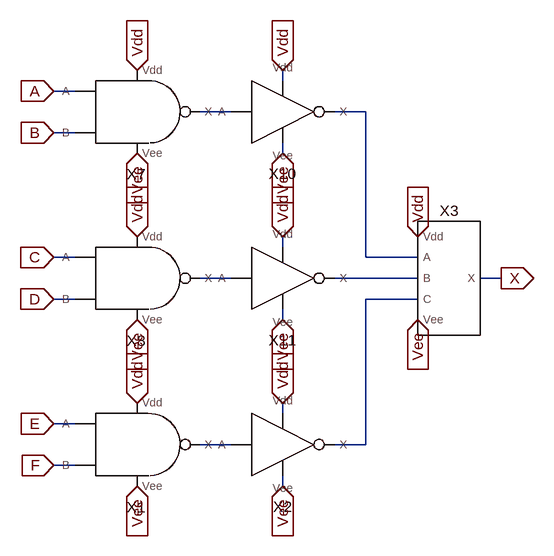
[diagram p0: schematic 6-NAND.asc]
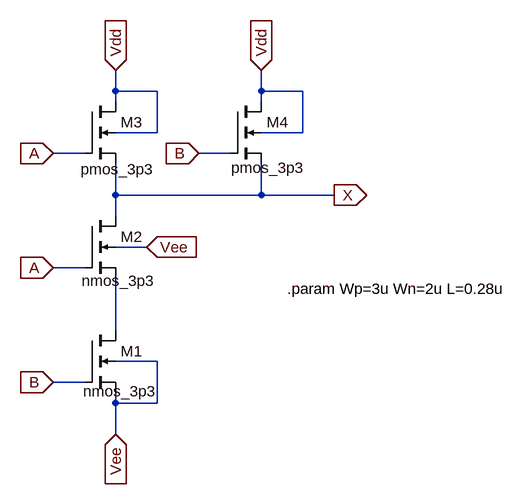
[diagram p1: sub-circuit nand2x1.asc]
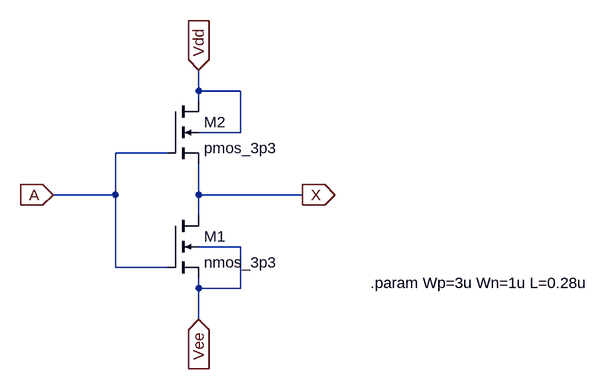
[diagram p2: sub-circuit invx1.asc]
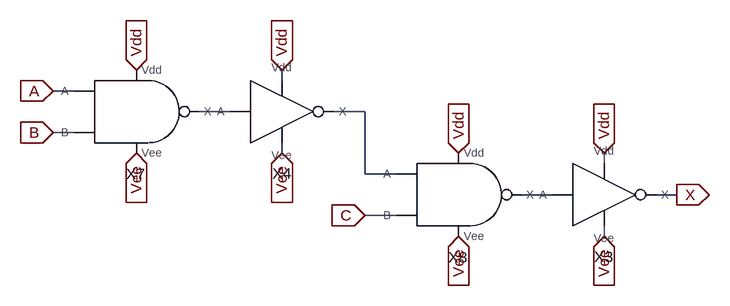
[diagram p3: sub-circuit 3-nand.asc]
6-NAND.asc, the LTspice schematic file:
Version 4.1
SHEET 1 880 680
WIRE -32 -64 -32 -80
WIRE -352 -48 -384 -48
WIRE -112 -16 -160 -16
WIRE 96 -16 48 -16
WIRE -352 16 -384 16
WIRE -32 48 -32 32
WIRE -32 192 -32 176
WIRE -352 208 -384 208
WIRE 96 208 96 -16
WIRE 176 208 96 208
WIRE -112 240 -160 240
WIRE 176 240 48 240
WIRE 304 240 272 240
WIRE -352 272 -384 272
WIRE 176 272 96 272
WIRE -32 304 -32 288
WIRE -32 448 -32 432
WIRE -352 464 -384 464
WIRE -112 496 -160 496
WIRE 96 496 96 272
WIRE 96 496 48 496
WIRE -352 528 -384 528
WIRE -32 560 -32 544
FLAG -256 48 Vee
IOPIN -256 48 In
FLAG -32 -80 Vdd
IOPIN -32 -80 In
FLAG -32 48 Vee
IOPIN -32 48 In
FLAG -256 304 Vee
IOPIN -256 304 In
FLAG -32 176 Vdd
IOPIN -32 176 In
FLAG -32 304 Vee
IOPIN -32 304 In
FLAG -384 -48 A
IOPIN -384 -48 In
FLAG -384 16 B
IOPIN -384 16 In
FLAG -384 208 C
IOPIN -384 208 In
FLAG -384 272 D
IOPIN -384 272 In
FLAG -256 -80 Vdd
IOPIN -256 -80 In
FLAG -256 176 Vdd
IOPIN -256 176 In
FLAG -256 560 Vee
IOPIN -256 560 In
FLAG -32 432 Vdd
IOPIN -32 432 In
FLAG -32 560 Vee
IOPIN -32 560 In
FLAG -384 464 E
IOPIN -384 464 In
FLAG -384 528 F
IOPIN -384 528 In
FLAG -256 432 Vdd
IOPIN -256 432 In
FLAG 176 176 Vdd
IOPIN 176 176 In
FLAG 176 304 Vee
IOPIN 176 304 In
FLAG 304 240 X
IOPIN 304 240 Out
SYMBOL NAND2x1 -256 -16 R0
SYMATTR InstName X7
SYMBOL NAND2x1 -256 240 R0
SYMATTR InstName X8
SYMBOL INVx1 -32 -16 R0
SYMATTR InstName X10
SYMBOL INVx1 -32 240 R0
SYMATTR InstName X11
SYMBOL NAND2x1 -256 496 R0
SYMATTR InstName X1
SYMBOL INVx1 -32 496 R0
SYMATTR InstName X2
SYMBOL 3-NAND 224 240 R0
SYMATTR InstName X3

nand2x1.asc, the sub-circuit schematic file:
Version 4.1
SHEET 1 900 680
WIRE -96 32 -96 0
WIRE -32 32 -96 32
WIRE 128 32 128 0
WIRE 192 32 128 32
WIRE -96 48 -96 32
WIRE 128 48 128 32
WIRE -32 96 -32 32
WIRE -32 96 -96 96
WIRE 192 96 192 32
WIRE 192 96 128 96
WIRE -144 128 -192 128
WIRE 80 128 32 128
WIRE -96 192 -96 144
WIRE 128 192 128 144
WIRE 128 192 -96 192
WIRE 240 192 128 192
WIRE -96 224 -96 192
WIRE -48 272 -96 272
WIRE -144 304 -192 304
WIRE -96 400 -96 320
WIRE -32 448 -96 448
WIRE -144 480 -192 480
WIRE -96 512 -96 496
WIRE -32 512 -32 448
WIRE -32 512 -96 512
WIRE -96 560 -96 512
FLAG -96 0 Vdd
IOPIN -96 0 In
FLAG -192 128 A
IOPIN -192 128 In
FLAG 240 192 X
IOPIN 240 192 Out
FLAG 128 0 Vdd
IOPIN 128 0 In
FLAG -192 304 A
IOPIN -192 304 In
FLAG -192 480 B
IOPIN -192 480 In
FLAG 32 128 B
IOPIN 32 128 In
FLAG -96 560 Vee
IOPIN -96 560 In
FLAG -48 272 Vee
IOPIN -48 272 In
SYMBOL nmos4 -144 400 R0
WINDOW 3 -2 94 Left 2
SYMATTR Value nmos_3p3
SYMATTR InstName M1
SYMATTR Value2 l={L} w={Wn}
SYMBOL nmos4 -144 48 R0
WINDOW 3 -6 104 Left 2
SYMATTR Value pmos_3p3
SYMATTR InstName M3
SYMATTR Value2 l={L} w={Wp}
SYMBOL nmos4 80 48 R0
WINDOW 3 2 102 Left 2
SYMATTR Value pmos_3p3
SYMATTR InstName M4
SYMATTR Value2 l={L} w={Wp}
SYMBOL nmos4 -144 224 R0
WINDOW 3 -4 100 Left 2
SYMATTR Value nmos_3p3
SYMATTR InstName M2
SYMATTR Value2 l={L} w={Wn}
TEXT 168 336 Left 2 !.param Wp=3u Wn=2u L=0.28u

invx1.asc, the sub-circuit schematic file:
Version 4
SHEET 1 2776 836
WIRE 416 -16 416 -48
WIRE 480 -16 416 -16
WIRE 416 0 416 -16
WIRE 480 48 480 -16
WIRE 480 48 416 48
WIRE 368 80 288 80
WIRE 288 144 288 80
WIRE 288 144 192 144
WIRE 416 144 416 96
WIRE 576 144 416 144
WIRE 416 176 416 144
WIRE 480 224 416 224
WIRE 288 256 288 144
WIRE 368 256 288 256
WIRE 416 288 416 272
WIRE 480 288 480 224
WIRE 480 288 416 288
WIRE 416 336 416 288
FLAG 416 -48 Vdd
IOPIN 416 -48 In
FLAG 192 144 A
IOPIN 192 144 In
FLAG 576 144 X
IOPIN 576 144 Out
FLAG 416 336 Vee
IOPIN 416 336 In
SYMBOL nmos4 368 176 R0
SYMATTR InstName M1
SYMATTR Value nmos_3p3
SYMATTR Value2 l={L} w={Wn}
SYMBOL nmos4 368 0 R0
SYMATTR InstName M2
SYMATTR Value pmos_3p3
SYMATTR Value2 l={L} w={Wp}
TEXT 680 280 Left 2 !.param Wp=3u Wn=1u L=0.28u

3-nand.asc, the sub-circuit schematic file:
Version 4.1
SHEET 1 880 680
WIRE 32 -32 32 -48
WIRE -288 -16 -320 -16
WIRE -48 16 -96 16
WIRE 160 16 112 16
WIRE -288 48 -320 48
WIRE 32 80 32 64
WIRE 528 96 528 80
WIRE 160 112 160 16
WIRE 208 112 160 112
WIRE 448 144 400 144
WIRE 640 144 608 144
WIRE 208 176 160 176
WIRE 528 208 528 192
FLAG -192 80 Vee
IOPIN -192 80 In
FLAG 32 -48 Vdd
IOPIN 32 -48 In
FLAG 32 80 Vee
IOPIN 32 80 In
FLAG 304 208 Vee
IOPIN 304 208 In
FLAG 528 80 Vdd
IOPIN 528 80 In
FLAG 528 208 Vee
IOPIN 528 208 In
FLAG 640 144 X
IOPIN 640 144 Out
FLAG -320 -16 A
IOPIN -320 -16 In
FLAG -320 48 B
IOPIN -320 48 In
FLAG 160 176 C
IOPIN 160 176 In
FLAG -192 -48 Vdd
IOPIN -192 -48 In
FLAG 304 80 Vdd
IOPIN 304 80 In
SYMBOL INVx1 528 144 R0
SYMATTR InstName X3
SYMBOL INVx1 32 16 R0
SYMATTR InstName X4
SYMBOL NAND2x1 -192 16 R0
SYMATTR InstName X7
SYMBOL NAND2x1 304 144 R0
SYMATTR InstName X8

The netlist it stands for:
* 6-NAND.asc
X§X7 A B Vdd N001 Vee nand2x1
X§X8 C D Vdd N003 Vee nand2x1
X§X10 N001 Vdd N002 Vee invx1
X§X11 N003 Vdd N004 Vee invx1
X§X1 E F Vdd N006 Vee nand2x1
X§X2 N006 Vdd N005 Vee invx1
X§X3 N002 N004 N005 Vdd Vee X 3-nand

* block symbol definitions
.subckt nand2x1 A B Vdd X Vee
M1 N001 B Vee Vee nmos_3p3 l={L} w={Wn}
M3 Vdd A X Vdd pmos_3p3 l={L} w={Wp}
M4 Vdd B X Vdd pmos_3p3 l={L} w={Wp}
M2 X A N001 Vee nmos_3p3 l={L} w={Wn}
.param Wp=3u Wn=2u L=0.28u
.ends nand2x1

.subckt invx1 A Vdd X Vee
M1 X A Vee Vee nmos_3p3 l={L} w={Wn}
M2 Vdd A X Vdd pmos_3p3 l={L} w={Wp}
.param Wp=3u Wn=1u L=0.28u
.ends invx1

.subckt 3-nand A B C Vdd Vee X
X§X3 N003 Vdd X Vee invx1
X§X4 N001 Vdd N002 Vee invx1
X§X7 A B Vdd N001 Vee nand2x1
X§X8 N002 C Vdd N003 Vee nand2x1
.ends 3-nand

.model NMOS NMOS
.model PMOS PMOS
.lib standard.mos
.backanno
.end